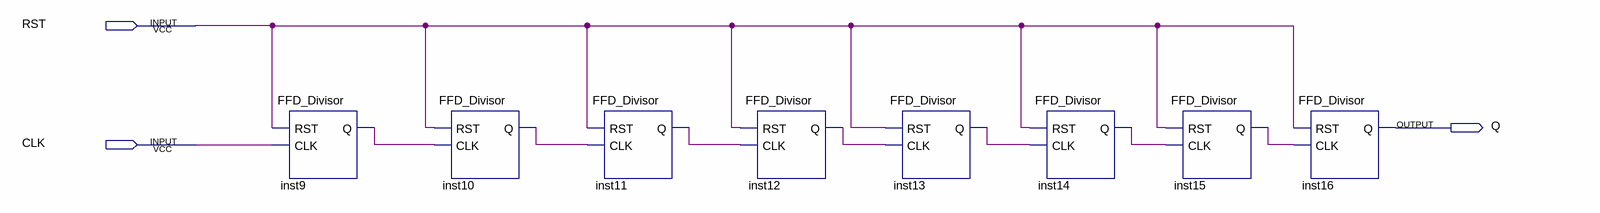
[diagram p0: schematic sheet]
// Quartus schematic DivisorFrequencia.bdf as structural Verilog: 8 symbols, 3 pins
module DivisorFrequencia (
  input  RST,
  input  CLK,
  output Q
);

  wire inst9_q, inst10_q, inst11_q, inst12_q, inst13_q, inst14_q, inst15_q;

  FFD_Divisor inst9 (.RST(RST), .CLK(CLK), .Q(inst9_q));
  FFD_Divisor inst10 (.RST(RST), .CLK(inst9_q), .Q(inst10_q));
  FFD_Divisor inst11 (.RST(RST), .CLK(inst10_q), .Q(inst11_q));
  FFD_Divisor inst12 (.RST(RST), .CLK(inst11_q), .Q(inst12_q));
  FFD_Divisor inst13 (.RST(RST), .CLK(inst12_q), .Q(inst13_q));
  FFD_Divisor inst14 (.RST(RST), .CLK(inst13_q), .Q(inst14_q));
  FFD_Divisor inst15 (.RST(RST), .CLK(inst14_q), .Q(inst15_q));
  FFD_Divisor inst16 (.RST(RST), .CLK(inst15_q), .Q(Q));
endmodule
